# EAGLE schematic DipSeq_board_12HP_CD4028_20150414 (EAGLE 7.1.0)

## Sheet 1 of 3: muxes
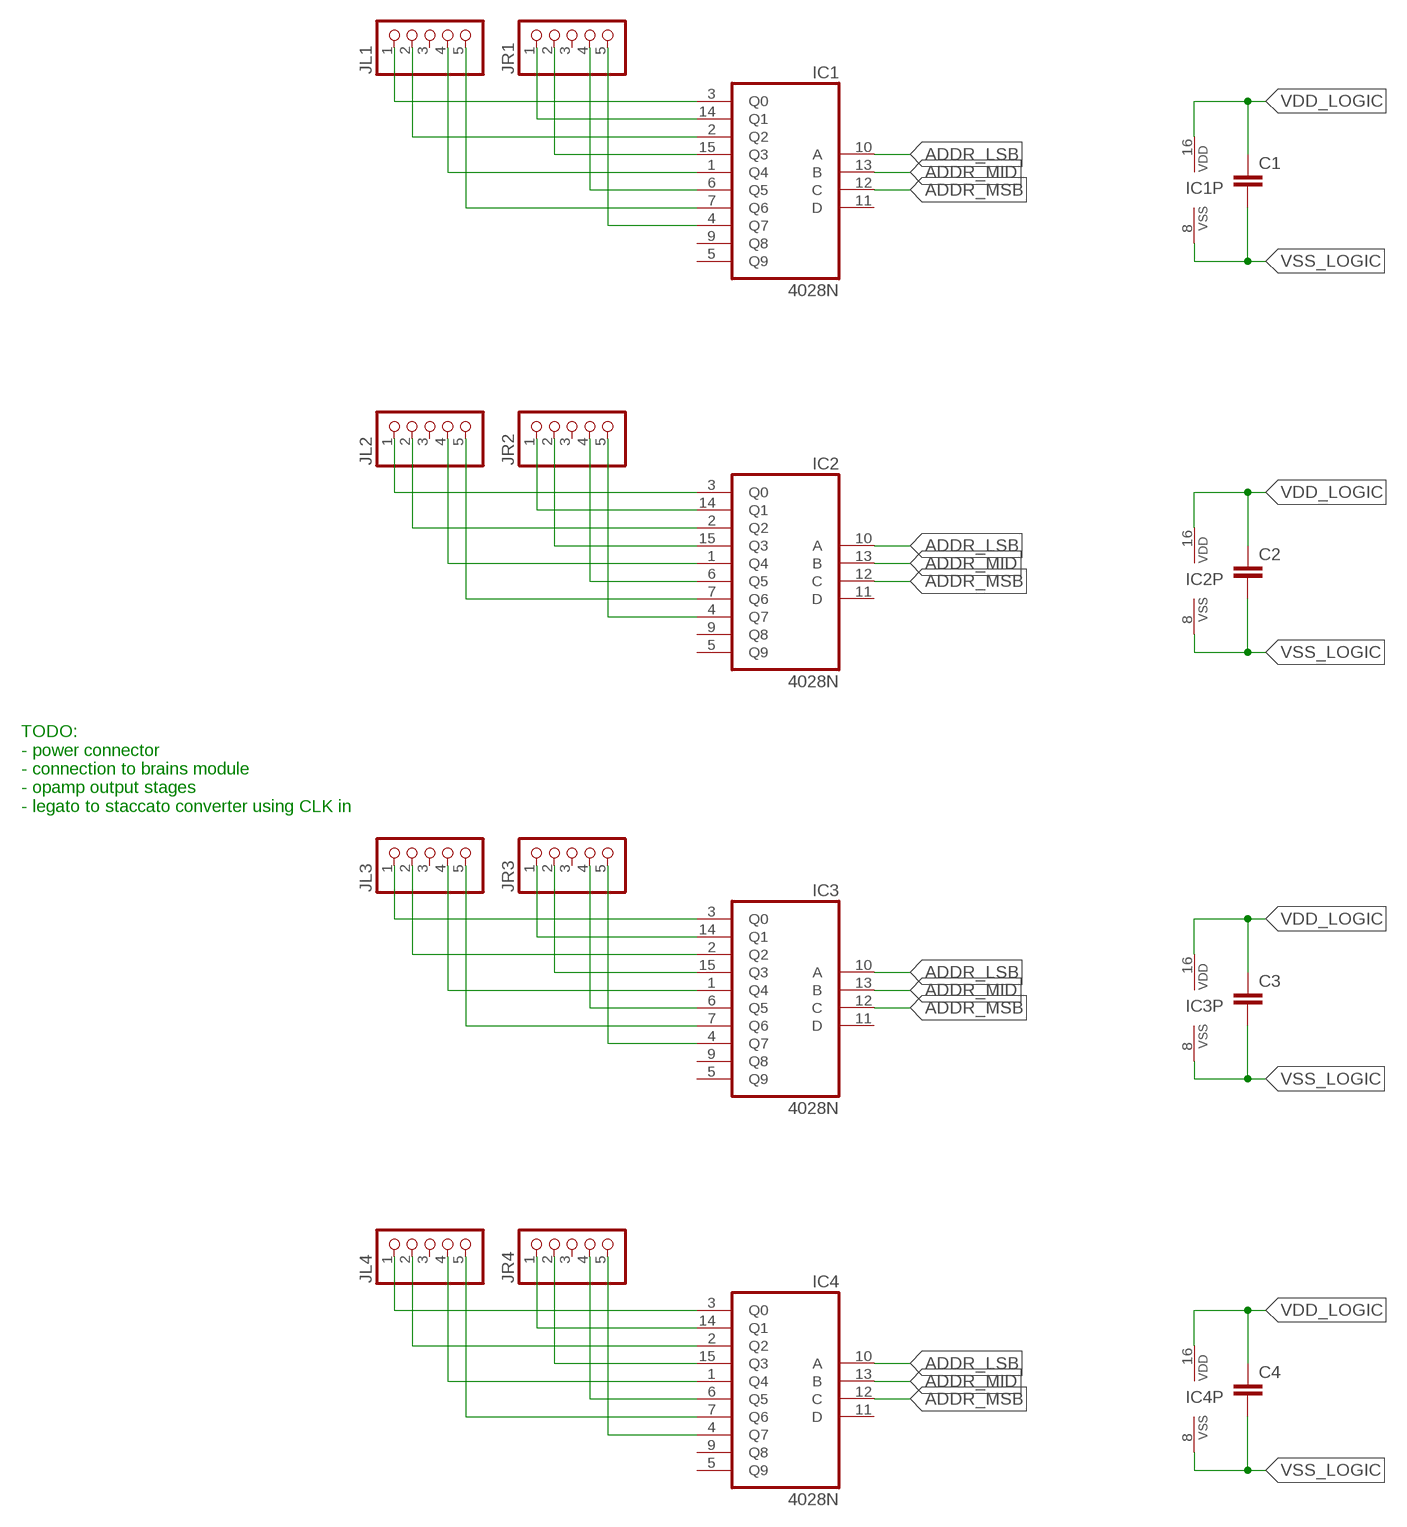
[diagram p0: schematic, sheet 1]

### Parts
C1  C-EU  [CAP_0805]
C2  C-EU  [CAP_0805]
C3  C-EU  [CAP_0805]
C4  C-EU  [CAP_0805]
IC1  4028N  [DIL16]
IC2  4028N  [DIL16]
IC3  4028N  [DIL16]
IC4  4028N  [DIL16]
JL1  PINHD-1X5  [1X05]
JL2  PINHD-1X5  [1X05]
JL3  PINHD-1X5  [1X05]
JL4  PINHD-1X5  [1X05]
JR1  PINHD-1X5  [1X05]
JR2  PINHD-1X5  [1X05]
JR3  PINHD-1X5  [1X05]
JR4  PINHD-1X5  [1X05]

### Nets
ADDR_LSB: IC2.10(A) IC3.10(A) IC4.10(A)
ADDR_MID: IC2.13(B) IC3.13(B) IC4.13(B)
ADDR_MSB: IC2.12(C) IC3.12(C) IC4.12(C)
S1: IC1.3(Q0) JL1.1
S2: IC1.14(Q1) JR1.1
S3: IC1.2(Q2) JL1.2
S4: IC1.15(Q3) JR1.2
S5: IC1.1(Q4) JL1.4
S6: IC1.6(Q5) JR1.4
S7: IC1.7(Q6) JL1.5
S8: IC1.4(Q7) JR1.5
S9: IC2.3(Q0) JL2.1
S10: IC2.2(Q2) JL2.2
S11: IC2.1(Q4) JL2.4
S12: IC2.7(Q6) JL2.5
S13: IC2.14(Q1) JR2.1
S14: IC2.15(Q3) JR2.2
S15: IC2.6(Q5) JR2.4
S16: IC2.4(Q7) JR2.5
S17: IC3.3(Q0) JL3.1
S18: IC3.2(Q2) JL3.2
S19: IC3.1(Q4) JL3.4
S20: IC3.7(Q6) JL3.5
S21: IC3.14(Q1) JR3.1
S22: IC3.15(Q3) JR3.2
S23: IC3.6(Q5) JR3.4
S24: IC3.4(Q7) JR3.5
S25: IC4.3(Q0) JL4.1
S26: IC4.2(Q2) JL4.2
S27: IC4.1(Q4) JL4.4
S28: IC4.7(Q6) JL4.5
S29: IC4.14(Q1) JR4.1
S30: IC4.15(Q3) JR4.2
S31: IC4.6(Q5) JR4.4
S32: IC4.4(Q7) JR4.5
VDD_LOGIC: C1.1 C2.1 C3.1 C4.1 IC1.16(VDD) IC2.16(VDD) IC3.16(VDD) IC4.16(VDD)
VSS_LOGIC: C1.2 C2.2 C3.2 C4.2 IC1.8(VSS) IC2.8(VSS) IC3.8(VSS) IC4.8(VSS)
Unconnected: IC1.5(Q9) IC1.9(Q8) IC1.10(A) IC1.11(D) IC1.12(C) IC1.13(B) IC2.5(Q9) IC2.9(Q8) IC2.11(D) IC3.5(Q9) IC3.9(Q8) IC3.11(D) IC4.5(Q9) IC4.9(Q8) IC4.11(D) JL1.3 JL2.3 JL3.3 JL4.3 JR1.3 JR2.3 JR3.3 JR4.3

### Notes on the sheet
- TODO:
  - power connector
  - connection to brains module
  - opamp output stages
  - legato to staccato converter using CLK in

## Sheet 2 of 3: outputs
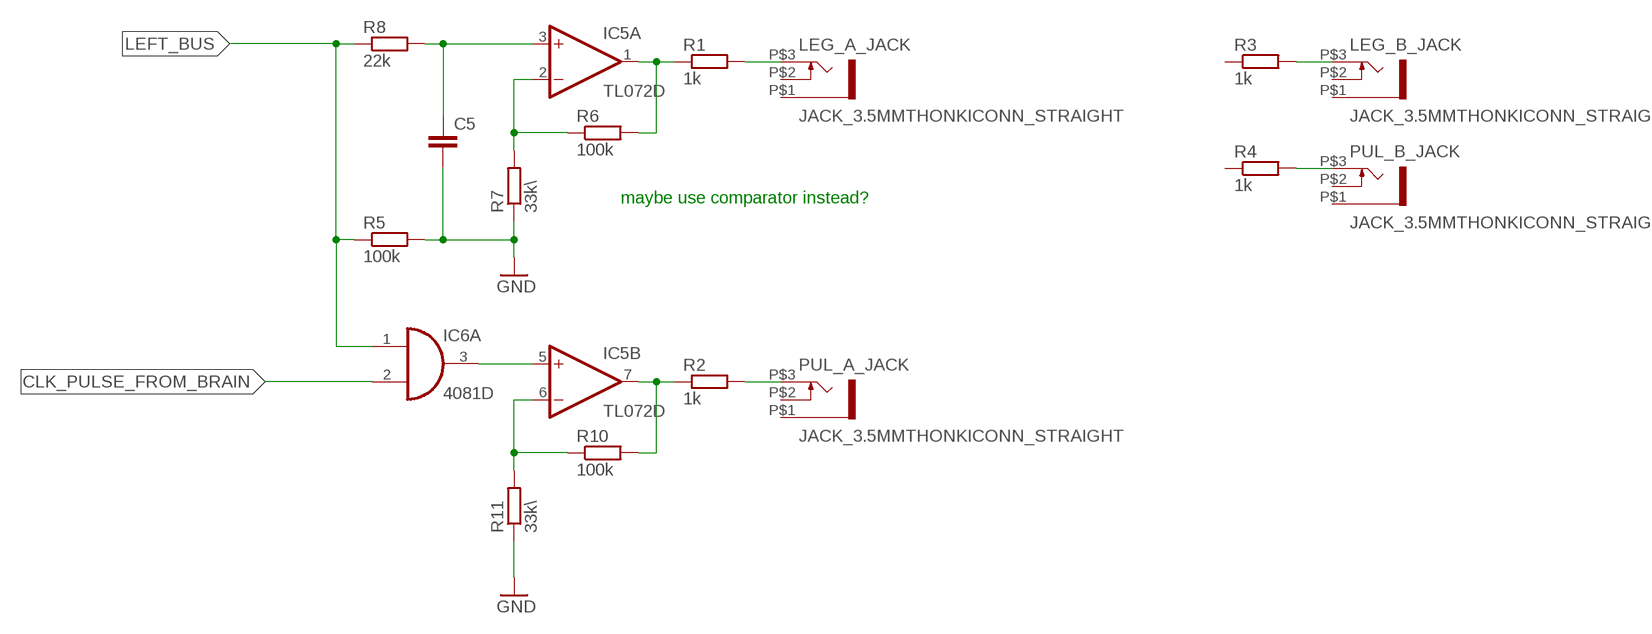
[diagram p1: schematic, sheet 2]

### Parts
C5  C-EU  [CAP_0805]
IC5  TL072D  [SO08]
IC6  4081D  [SO14]
LEG_A_JACK  JACK_3.5MMTHONKICONN_STRAIGHT  [THONKICONN_LAYOUT]
LEG_B_JACK  JACK_3.5MMTHONKICONN_STRAIGHT  [THONKICONN_LAYOUT]
PUL_A_JACK  JACK_3.5MMTHONKICONN_STRAIGHT  [THONKICONN_LAYOUT]
PUL_B_JACK  JACK_3.5MMTHONKICONN_STRAIGHT  [THONKICONN_LAYOUT]
R1  1k  R-EU_R0805W  [R_0805_MINE]
R2  1k  R-EU_R0805W  [R_0805_MINE]
R3  1k  R-EU_R0805W  [R_0805_MINE]
R4  1k  R-EU_R0805W  [R_0805_MINE]
R5  100k  R-EU_R0805W  [R_0805_MINE]
R6  100k  R-EU_R0805W  [R_0805_MINE]
R7  33k\  R-EU_R0805W  [R_0805_MINE]
R8  22k  R-EU_R0805W  [R_0805_MINE]
R10  100k  R-EU_R0805W  [R_0805_MINE]
R11  33k\  R-EU_R0805W  [R_0805_MINE]

### Nets
CLK_PULSE_FROM_BRAIN: IC6.2(A:I1)
GND: C5.2 R5.2 R7.1 R11.1
LEFT_BUS: IC6.1(A:I0) R5.1 R8.1
N$1: LEG_A_JACK.P$3(TIP) R1.2
N$2: PUL_A_JACK.P$3(TIP) R2.2
N$3: LEG_B_JACK.P$3(TIP) R3.2
N$4: PUL_B_JACK.P$3(TIP) R4.2
N$5: IC5.1(A:OUT) R1.1 R6.2
N$6: IC5.2(A:-IN) R6.1 R7.2
N$7: C5.1 IC5.3(A:+IN) R8.2
N$8: IC5.7(B:OUT) R2.1 R10.2
N$9: IC5.6(B:-IN) R10.1 R11.2
N$10: IC5.5(B:+IN) IC6.3(A:O)
Unconnected: IC6.4(B:O) IC6.5(B:I0) IC6.6(B:I1) IC6.8(C:I0) IC6.9(C:I1) IC6.10(C:O) IC6.11(D:O) IC6.12(D:I0) IC6.13(D:I1) LEG_A_JACK.P$1(SLEEVE) LEG_A_JACK.P$2(SWITCH) LEG_B_JACK.P$1(SLEEVE) LEG_B_JACK.P$2(SWITCH) PUL_A_JACK.P$1(SLEEVE) PUL_A_JACK.P$2(SWITCH) PUL_B_JACK.P$1(SLEEVE) PUL_B_JACK.P$2(SWITCH) R3.1 R4.1

### Notes on the sheet
- maybe use comparator instead?

## Sheet 3 of 3: other
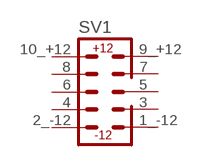
[diagram p2: schematic, sheet 3]

### Parts
SV1  BOXHEADER_10P  [MY_BOXHEADER_2X5]
Unconnected: SV1.1_-12 SV1.2_-12 SV1.3(3_GND) SV1.4(4_GND) SV1.5(5_GND) SV1.6(6_GND) SV1.7(7_GND) SV1.8(8_GND) SV1.9_+12 SV1.10_+12

## Power pins joined to a net without a drawn wire
V+: IC5.8(P:V+)
V-: IC5.4(P:V-)
VDD: IC6.14(P:VDD)
VSS: IC6.7(P:VSS)

## Library data of the parts
C1-C5 = amdagan:C-EU: CAPACITOR, European symbol
IC1-IC4 = 40xx:4028: BCD to decimal DECODER
IC5 = gm-ics:TL072: OP AMP
IC6 = 40xx:4081: Quad 2-input AND
JL1-JL4 JR1-JR4 = amdagan:PINHD-1X5: PIN HEADER
LEG_A_JACK LEG_B_JACK PUL_A_JACK PUL_B_JACK = amdagan:JACK_3.5MM
R1-R8 R10 R11 = amdagan:R-EU_: RESISTOR, European symbol
SV1 = amdagan:BOXHEADER_10P: HARTING